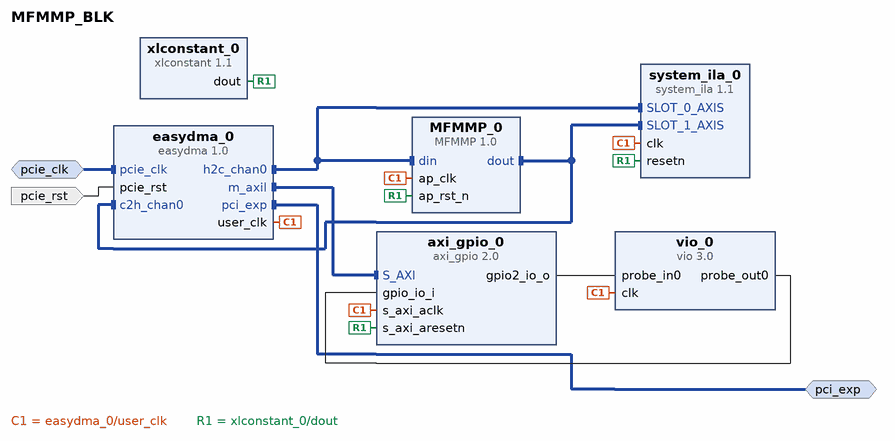
[diagram p0: block diagram of the top level]
# Vivado block design MFMMP_BLK, xcu200-fsgd2104-2-e, Vivado 2023.1
create_bd_design MFMMP_BLK

create_bd_intf_port -mode Slave -vlnv xilinx.com:interface:diff_clock_rtl:1.0 pcie_clk
create_bd_intf_port -mode Master -vlnv xilinx.com:interface:pcie_7x_mgt_rtl:1.0 pci_exp
create_bd_port -dir I -type rst pcie_rst

create_bd_cell -type ip -vlnv xilinx.com:ip:system_ila:1.1 system_ila_0
set_property -dict [list \
  CONFIG.C_NUM_MONITOR_SLOTS 2 \
  CONFIG.C_SLOT 1 \
  CONFIG.C_SLOT_0_INTF_TYPE xilinx.com:interface:axis_rtl:1.0 \
  CONFIG.C_SLOT_1_INTF_TYPE xilinx.com:interface:axis_rtl:1.0 \
] [get_bd_cells system_ila_0]
create_bd_cell -type ip -vlnv xilinx.com:ip:xlconstant:1.1 xlconstant_0
create_bd_cell -type ip -vlnv xilinx.com:ip:axi_gpio:2.0 axi_gpio_0
set_property -dict [list \
  CONFIG.C_ALL_INPUTS 1 \
  CONFIG.C_ALL_INPUTS_2 0 \
  CONFIG.C_ALL_OUTPUTS_2 1 \
  CONFIG.C_IS_DUAL 1 \
] [get_bd_cells axi_gpio_0]
create_bd_cell -type ip -vlnv xilinx.com:ip:vio:3.0 vio_0
set_property -dict {CONFIG.C_NUM_PROBE_IN 1 CONFIG.C_NUM_PROBE_OUT 1 CONFIG.C_PROBE_OUT0_WIDTH 32} [get_bd_cells vio_0]
create_bd_cell -type ip -vlnv clarkshen.com:user:easydma:1.0 easydma_0
create_bd_cell -type ip -vlnv xilinx.com:hls:MFMMP:1.0 MFMMP_0

# ---- connections ----

connect_bd_intf_net [get_bd_intf_pins easydma_0/c2h_chan0] [get_bd_intf_pins MFMMP_0/dout]
connect_bd_intf_net [get_bd_intf_pins easydma_0/c2h_chan0] [get_bd_intf_pins system_ila_0/SLOT_1_AXIS]
connect_bd_intf_net [get_bd_intf_pins easydma_0/h2c_chan0] [get_bd_intf_pins MFMMP_0/din]
connect_bd_intf_net [get_bd_intf_pins easydma_0/h2c_chan0] [get_bd_intf_pins system_ila_0/SLOT_0_AXIS]
connect_bd_intf_net [get_bd_intf_pins easydma_0/m_axil] [get_bd_intf_pins axi_gpio_0/S_AXI]
connect_bd_intf_net [get_bd_intf_ports pci_exp] [get_bd_intf_pins easydma_0/pci_exp]
connect_bd_intf_net -intf_net pcie_clk_0_1 [get_bd_intf_ports pcie_clk] [get_bd_intf_pins easydma_0/pcie_clk]
connect_bd_net [get_bd_pins axi_gpio_0/gpio2_io_o] [get_bd_pins vio_0/probe_in0]
connect_bd_net [get_bd_pins easydma_0/user_clk] \
  [get_bd_pins system_ila_0/clk] [get_bd_pins axi_gpio_0/s_axi_aclk] [get_bd_pins vio_0/clk] [get_bd_pins MFMMP_0/ap_clk]
connect_bd_net -net pcie_rst_0_1 [get_bd_ports pcie_rst] [get_bd_pins easydma_0/pcie_rst]
connect_bd_net [get_bd_pins vio_0/probe_out0] [get_bd_pins axi_gpio_0/gpio_io_i]
connect_bd_net [get_bd_pins xlconstant_0/dout] [get_bd_pins system_ila_0/resetn] [get_bd_pins axi_gpio_0/s_axi_aresetn] [get_bd_pins MFMMP_0/ap_rst_n]

# ---- address map ----
assign_bd_address -offset 0x00000000 -range 4G -target_address_space [get_bd_addr_spaces easydma_0/m_axil] [get_bd_addr_segs axi_gpio_0/S_AXI/Reg]

validate_bd_design
save_bd_design
